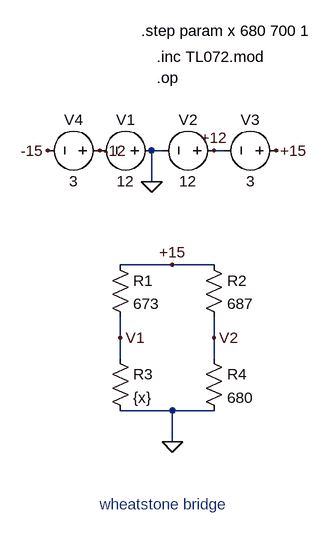
[diagram p0: schematic wheatstone.asc]
wheatstone.asc, the LTspice schematic file:
Version 4
SHEET 1 3256 748
WIRE 1312 -192 1296 -192
WIRE 1408 -192 1392 -192
WIRE 1296 -144 1296 -192
WIRE 1328 -16 1248 -16
WIRE 1392 -16 1328 -16
WIRE 1248 96 1248 64
WIRE 1392 96 1392 64
WIRE 1248 128 1248 96
WIRE 1392 128 1392 96
WIRE 1328 208 1248 208
WIRE 1392 208 1328 208
WIRE 1328 256 1328 208
FLAG 1296 -144 0
FLAG 1216 -192 -12
FLAG 1392 -192 +12
FLAG 1488 -192 +15
FLAG 1328 -16 +15
FLAG 1136 -192 -15
FLAG 1392 96 V2
FLAG 1248 96 V1
FLAG 1328 256 0
SYMBOL voltage 1312 -192 R90
WINDOW 0 -32 56 VBottom 2
WINDOW 3 32 56 VTop 2
SYMATTR InstName V1
SYMATTR Value 12
SYMBOL voltage 1408 -192 R90
WINDOW 0 -32 56 VBottom 2
WINDOW 3 32 56 VTop 2
SYMATTR InstName V2
SYMATTR Value 12
SYMBOL voltage 1504 -192 R90
WINDOW 0 -32 56 VBottom 2
WINDOW 3 32 56 VTop 2
SYMATTR InstName V3
SYMATTR Value 3
SYMBOL res 1232 -32 R0
SYMATTR InstName R1
SYMATTR Value 673
SYMBOL res 1376 -32 R0
SYMATTR InstName R2
SYMATTR Value 687
SYMBOL res 1232 112 R0
SYMATTR InstName R3
SYMATTR Value {x}
SYMBOL res 1376 112 R0
SYMATTR InstName R4
SYMATTR Value 680
SYMBOL voltage 1232 -192 R90
WINDOW 0 -32 56 VBottom 2
WINDOW 3 32 56 VTop 2
SYMATTR InstName V4
SYMATTR Value 3
TEXT 1304 -304 Left 2 !.op
TEXT 1304 -336 Left 2 !.inc TL072.mod
TEXT 1216 352 Left 2 ;wheatstone bridge
TEXT 1280 -376 Left 2 !.step param x 680 700 1

The netlist it stands for:
* wheatstone.asc
V1 0 -12 12
V2 +12 0 12
V3 +15 +12 3
R1 +15 V1 673
R2 +15 V2 687
R3 V1 0 {x}
R4 V2 0 680
V4 -12 -15 3
.op
.inc TL072.mod
* wheatstone bridge
.step param x 680 700 1
.backanno
.end

* Results of the author's LTspice run, read from the files saved beside the schematic
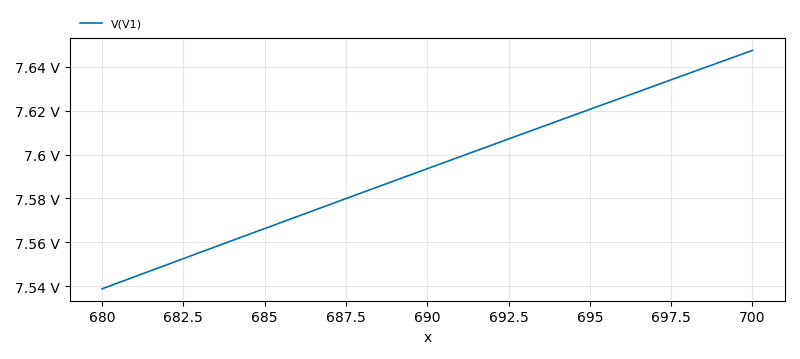
[diagram p1: Operating Point of wheatstone.asc, plotted from the saved traces]
* Operating Point, 1 run:
*   V(V1): 7.539 V at x=680 , 7.647 V at x=700 , min 7.539 V, max 7.647 V